# EAGLE design featherSynth (EAGLE 8.7.0)
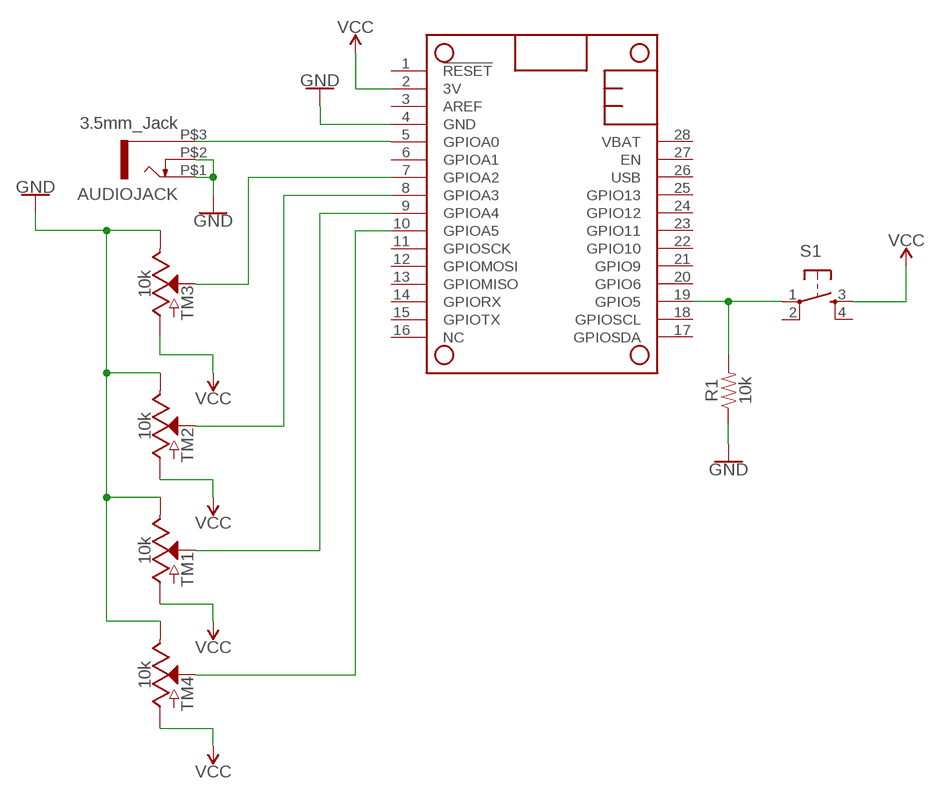
[diagram p0: schematic, sheet 1]

## Parts
AUDIOJACK  3.5mm_Jack  WQP-PJ301M-12_JACK  [WQP-PJ301M-12_JACK]
MS1  FEATHERWING  [FEATHERWING]
R1  10k  1KOHM-HORIZ-1/4W-5%  [AXIAL-0.3]
S1  TAC_SWITCHPTH  [TACTILE-PTH]
TM1  10k  POTENTIOMETER-PTH-9MM-1/20W-20%  [POT-PTH-ALPS]
TM2  10k  POTENTIOMETER-PTH-9MM-1/20W-20%  [POT-PTH-ALPS]
TM3  10k  POTENTIOMETER-PTH-9MM-1/20W-20%  [POT-PTH-ALPS]
TM4  10k  POTENTIOMETER-PTH-9MM-1/20W-20%  [POT-PTH-ALPS]

## Nets
GND: AUDIOJACK.P$1 AUDIOJACK.P$2 MS1.4(GND) R1.P$1 TM1.P$1(E) TM2.P$1(E) TM3.P$1(E) TM4.P$1(E)
N$1: AUDIOJACK.P$3 MS1.5(GPIOA0)
N$2: MS1.8(GPIOA3) TM2.P$2(S)
N$4: MS1.7(GPIOA2) TM3.P$2(S)
N$5: MS1.9(GPIOA4) TM1.P$2(S)
N$7: MS1.10(GPIOA5) TM4.P$2(S)
N$8: MS1.19(GPIO5) R1.P$2 S1.1
VCC: MS1.2(3V) S1.3 TM1.P$3(A) TM2.P$3(A) TM3.P$3(A) TM4.P$3(A)
Unconnected: MS1.1(!RESET) MS1.3(AREF) MS1.6(GPIOA1) MS1.11(GPIOSCK) MS1.12(GPIOMOSI) MS1.13(GPIOMISO) MS1.14(GPIORX) MS1.15(GPIOTX) MS1.16(NC) MS1.17(GPIOSDA) MS1.18(GPIOSCL) MS1.20(GPIO6) MS1.21(GPIO9) MS1.22(GPIO10) MS1.23(GPIO11) MS1.24(GPIO12) MS1.25(GPIO13) MS1.26(USB) MS1.27(EN) MS1.28(VBAT) S1.2 S1.4

## Library data of the parts
AUDIOJACK = thonkiconn:WQP-PJ301M-12_JACK
MS1 = adafruit:FEATHERWING
R1 = SparkFun-Resistors:1KOHM: 1kΩ resistor A resistor is a passive two-terminal electrical component that implements electrical resistance as a circuit element. Resistors act to reduce current flow, and, at the same time, act to lower voltage levels within circuits. - Wikipedia; PROD_ID: RES-08380; VALUE: 1k
S1 = SparkFun-Retired:TAC_SWITCH: Momentary Switch Button commonly used for reset or general input. Spark Fun Electronics SKU : COM-00097 SMT- SWCH-08247
TM1-TM4 = SparkFun-Resistors:POTENTIOMETER: Potentiometer (Pot) Three-terminal potentiometers, with an adjustable wiper and two adjustable resistors. A pot can be used to create a configurable voltage divider, or as a variable resistor. Variants ALPS_POT and ALPS_POT_KIT - PTH, breadboard compatible, 9mm square pots Rotary Potentiometer - Linear (10k ohm) <https://www.sparkfun.com/products/9288> (COM-09288) The KIT variant exposes copper on only one side of the PTH pad, so the part can only be assembled on one side of the PCB. Useful for beginner soldering kits.; PROD_ID: RES-09177; SF_SKU: COM-09288

## Board
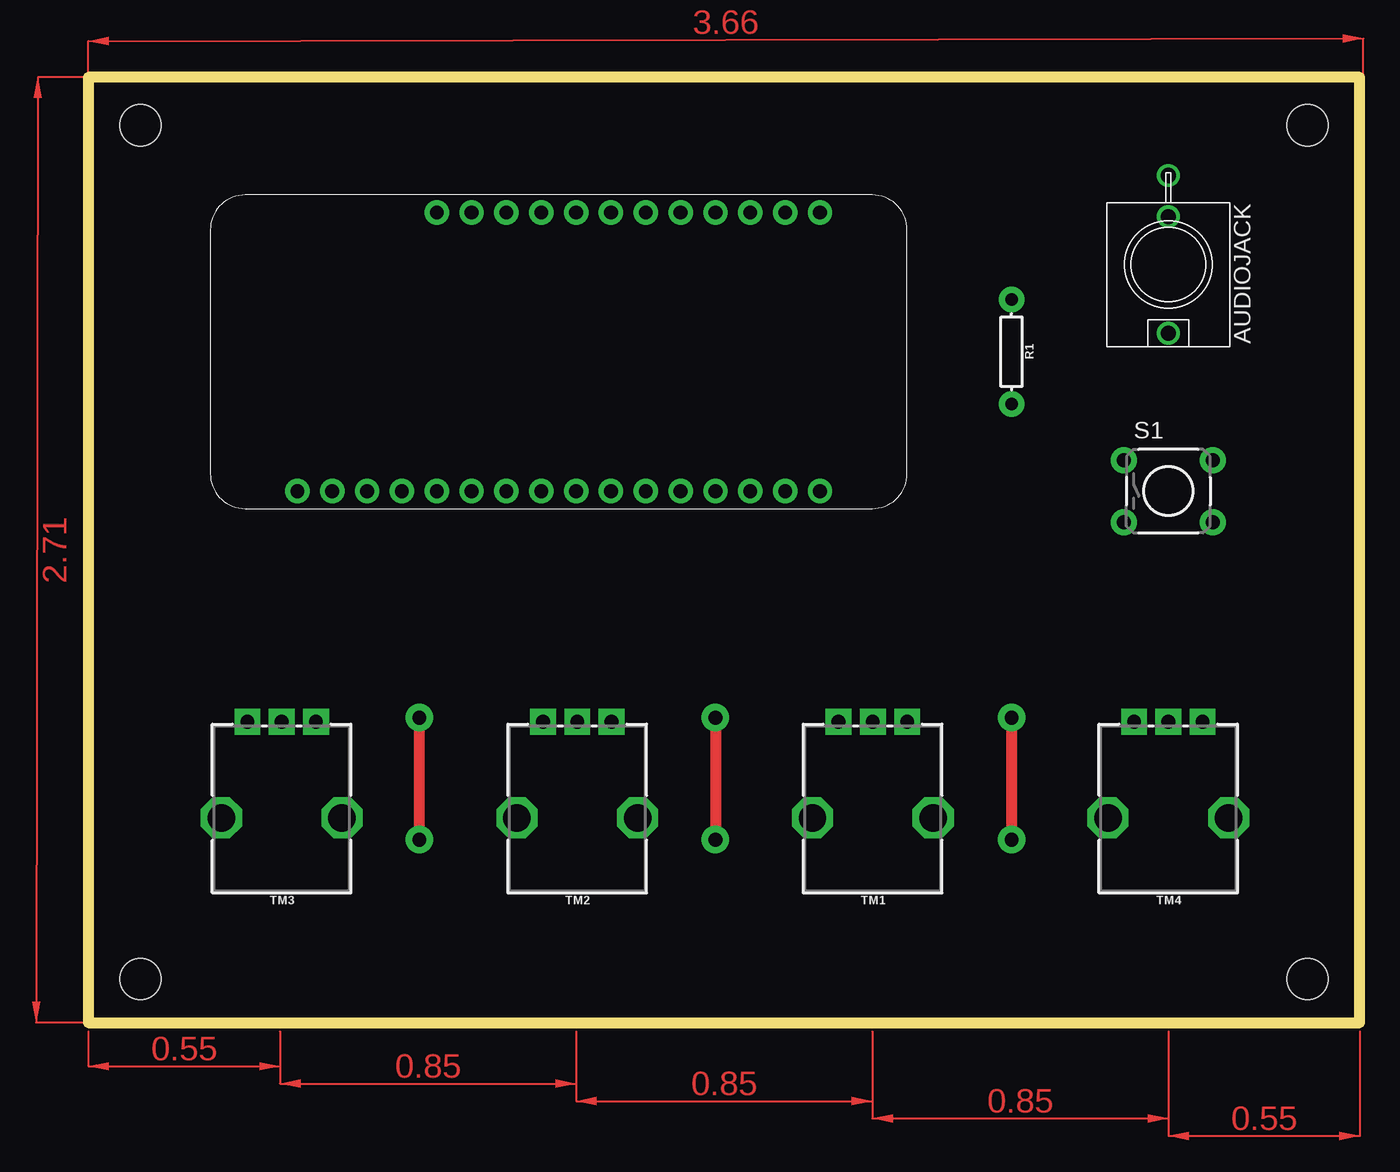
[diagram p1: board, top side]
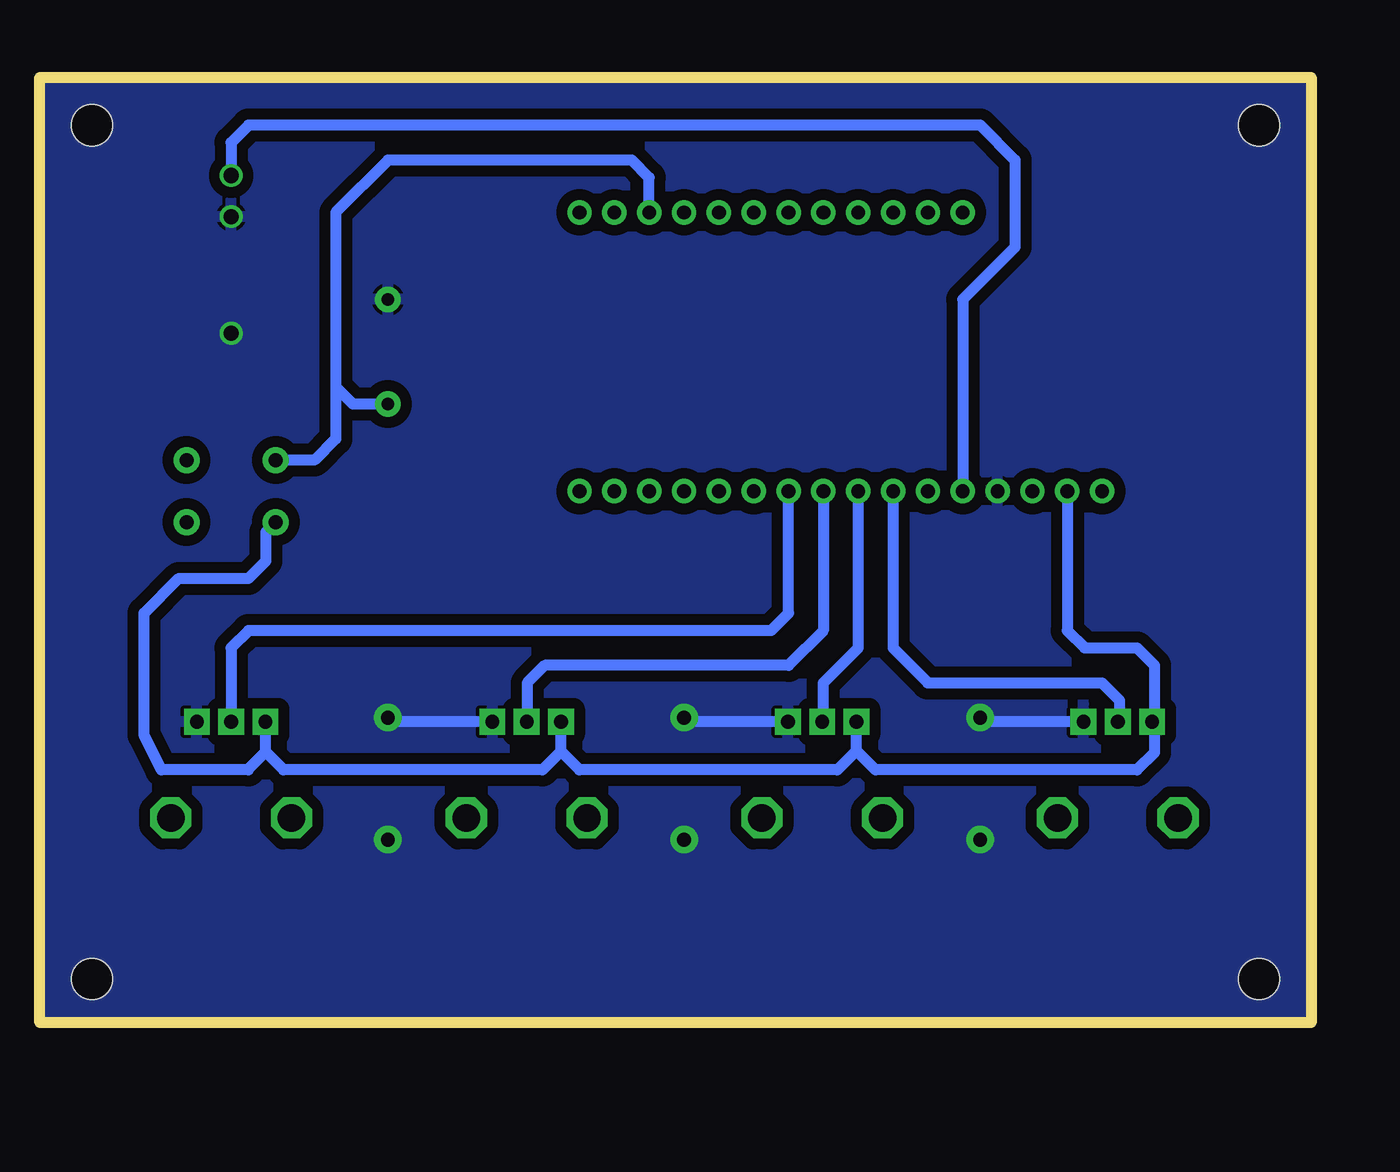
[diagram p2: board, bottom side, seen from below]

Size 92.69 x 68.89 mm. Coordinates in mm from the lower left corner, seen from the top.
Outline: 0,0 92.69,0 92.69,68.89 0,68.89 0,0
Copper layers (1*16): Top 0.035mm / dielectric 1.5mm / Bottom 0.035mm
Design rules "OthermillDRC_1_32_v2": minimum track width 8mil, minimum drill 0.8mm, track to track 0.794003125mm, track to pad 0.794003125mm, pad to pad 0.794003125mm, via to via 0.794003125mm, smd to smd 0mil, copper to edge 0mil, drill to drill 1mil, minimum pad ring 10mil, minimum via ring 10mil, stop-mask expansion 1mil, vias tented up to drill 30mil, thermal gap 10mil
Holes 3 mm at 3.81,65.41 88.9,65.41 88.9,3.18 3.81,3.18

### Footprints (pad centres in the part's own frame; a part is rotated, then mirrored left to right if it is on the bottom)
WQP-PJ301M-12_JACK = drill 1.1: P$1 0,5; P$2 0,-3.5; P$3 0,-6.5
FEATHERWING = drill 1 pad 1.778: 1 6.35,1.27; 2 8.89,1.27; 3 11.43,1.27; 4 13.97,1.27; 5 16.51,1.27; 6 19.05,1.27; 7 21.59,1.27; 8 24.13,1.27; 9 26.67,1.27; 10 29.21,1.27; 11 31.75,1.27; 12 34.29,1.27; 13 36.83,1.27; 14 39.37,1.27; 15 41.91,1.27; 16 44.45,1.27; 17 44.45,21.59; 18 41.91,21.59; 19 39.37,21.59; 20 36.83,21.59; 21 34.29,21.59; 22 31.75,21.59; 23 29.21,21.59; 24 26.67,21.59; 25 24.13,21.59; 26 21.59,21.59; 27 19.05,21.59; 28 16.51,21.59
AXIAL-0.3 = drill 0.9 pad 1.88: P$1 -3.81,0; P$2 3.81,0
TACTILE-PTH = drill 1.016 pad 1.88: 1 -3.251,2.261; 2 3.251,2.261; 3 -3.251,-2.261; 4 3.251,-2.261
POT-PTH-ALPS = drill 1 pad 1.88 square: P$1 7,-2.5; P$2 7,0; P$3 7,2.5 | drill 2 octagon: P$4 0,-4.4; P$5 0,4.4

### Placement (x,y rotation side)
AUDIOJACK  78.74,55.25 180 top
MS1  8.89,37.47 0 top
R1  67.31,48.9 270 top
S1  78.74,38.73 0 top
TM1  57.19,14.92 90 top
TM2  35.64,14.92 90 top
TM3  14.1,14.92 90 top
TM4  78.74,14.92 90 top

### Tracks (layer width: path | path; a pad name or v marks a point on that pad's centre or on a via)
GND  (via drill 1 pad 2)
  Top 0.813: v24.13,22.23 v24.13,13.34 | v67.31,22.23 v67.31,13.34 | v45.72,22.23 v45.72,13.34
  Bottom 0.813: TM3.P$1 23.83,21.92 v24.13,22.23 | TM1.P$1 67.01,21.92 v67.31,22.23 | TM2.P$1 45.42,21.92 v45.72,22.23
  pour Bottom: 0.13,0.13 92.71,0.13 92.71,68.83 0,68.83
N$1
  Bottom 0.813: AUDIOJACK.P$3 78.74,64.14 77.47,65.41 24.13,65.41 21.59,62.87 21.59,56.52 25.4,52.7 MS1.5
N$2
  Bottom 0.813: TM2.P$2 35.56,22.01 35.56,24.77 33.02,27.31 MS1.8
N$4
  Bottom 0.813: TM3.P$2 13.97,22.05 13.97,23.5 15.24,24.77 27.94,24.77 30.48,27.31 MS1.7
N$5
  Bottom 0.813: TM1.P$2 57.15,21.96 57.15,24.77 55.88,26.04 38.1,26.04 35.56,28.57 MS1.9
N$7
  Bottom 0.813: TM4.P$2 78.74,27.31 77.47,28.57 39.37,28.57 38.1,29.85 MS1.10 | TM4.P$2
N$8
  Bottom 0.813: MS1.19 48.26,61.59 49.53,62.87 67.31,62.87 71.12,59.06 71.12,46.36 | 71.12,46.36 71.12,42.55 72.67,41 S1.1 | R1.P$2 69.85,45.09 71.12,46.36
VCC
  Bottom 0.813: 32.84,22.23 TM2.P$3 33.15,19.81 | MS1.2 17.78,28.57 16.51,27.31 12.7,27.31 11.43,26.04 11.43,22.09 TM3.P$3 11.43,21.75 11.43,19.68 12.7,18.42 31.75,18.42 33.15,19.81 | 33.15,19.81 34.54,18.42 53.34,18.42 54.69,19.77 | 54.69,19.77 TM1.P$3 | 54.69,19.77 56.05,18.42 74.93,18.42 76.24,19.73 | 76.24,19.73 TM4.P$3 | 76.24,19.73 77.47,18.5 77.47,18.42 83.82,18.42 85.09,20.96 85.09,29.85 82.55,32.39 77.47,32.39 76.2,33.66 76.2,35.76 S1.3
(copper drawn outside any net)
  shapes: Top area x7